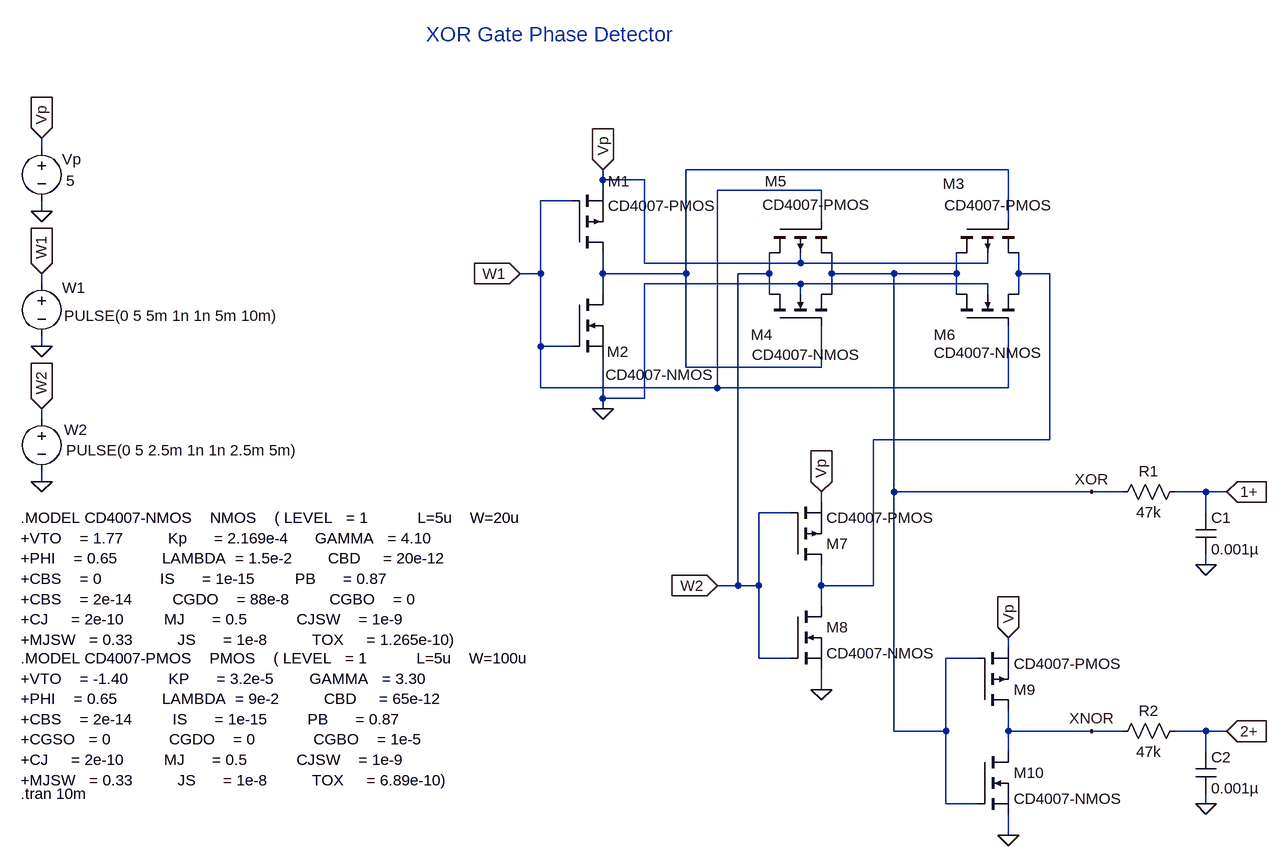
[diagram p0: schematic xor_gate_phase_detector.asc]
xor_gate_phase_detector.asc, the LTspice schematic file:
Version 4
SHEET 1 1500 1752
WIRE -1104 112 -1104 96
WIRE 384 144 -112 144
WIRE -240 160 -240 144
WIRE -176 160 -240 160
WIRE -240 176 -240 160
WIRE 96 176 -64 176
WIRE -288 192 -336 192
WIRE -1104 208 -1104 192
WIRE 96 224 96 176
WIRE 384 224 384 144
WIRE -176 288 -176 160
WIRE 64 288 64 272
WIRE 64 288 -176 288
WIRE 352 288 352 272
WIRE 352 288 64 288
WIRE -336 304 -336 192
WIRE -336 304 -368 304
WIRE -240 304 -240 272
WIRE -112 304 -112 144
WIRE -112 304 -240 304
WIRE 16 304 16 272
WIRE 16 304 -32 304
WIRE 112 304 112 272
WIRE 208 304 112 304
WIRE 304 304 304 272
WIRE 304 304 208 304
WIRE 400 304 400 272
WIRE 448 304 400 304
WIRE -1104 320 -1104 304
WIRE 64 320 -176 320
WIRE 352 320 64 320
WIRE -240 336 -240 304
WIRE 16 336 16 304
WIRE 64 336 64 320
WIRE 112 336 112 304
WIRE 304 336 304 304
WIRE 352 336 352 320
WIRE 400 336 400 304
WIRE -1104 416 -1104 400
WIRE -336 416 -336 304
WIRE -288 416 -336 416
WIRE -112 448 -112 304
WIRE 96 448 96 384
WIRE 96 448 -112 448
WIRE -336 480 -336 416
WIRE -64 480 -64 176
WIRE -64 480 -336 480
WIRE 384 480 384 384
WIRE 384 480 -64 480
WIRE -240 496 -240 432
WIRE -176 496 -176 320
WIRE -176 496 -240 496
WIRE -240 512 -240 496
WIRE -1104 528 -1104 512
WIRE 448 560 448 304
WIRE 448 560 176 560
WIRE -1104 624 -1104 608
WIRE 208 640 208 304
WIRE 512 640 208 640
WIRE 560 640 512 640
WIRE 688 640 640 640
WIRE 720 640 688 640
WIRE 96 656 96 640
WIRE 48 672 0 672
WIRE 688 672 688 640
WIRE 688 752 688 736
WIRE -32 784 -32 304
WIRE -32 784 -64 784
WIRE 0 784 0 672
WIRE 0 784 -32 784
WIRE 96 784 96 752
WIRE 176 784 176 560
WIRE 176 784 96 784
WIRE 96 816 96 784
WIRE 384 880 384 864
WIRE 0 896 0 784
WIRE 48 896 0 896
WIRE 336 896 288 896
WIRE 96 944 96 912
WIRE 208 1008 208 640
WIRE 288 1008 288 896
WIRE 288 1008 208 1008
WIRE 384 1008 384 976
WIRE 512 1008 384 1008
WIRE 560 1008 512 1008
WIRE 688 1008 640 1008
WIRE 720 1008 688 1008
WIRE 384 1040 384 1008
WIRE 688 1040 688 1008
WIRE 288 1120 288 1008
WIRE 336 1120 288 1120
WIRE 688 1120 688 1104
WIRE 384 1168 384 1136
FLAG -240 512 0
FLAG -240 144 Vp
IOPIN -240 144 In
FLAG -368 304 W1
IOPIN -368 304 In
FLAG -64 784 W2
IOPIN -64 784 In
FLAG 96 944 0
FLAG -1104 416 0
FLAG -1104 208 0
FLAG -1104 96 Vp
IOPIN -1104 96 In
FLAG -1104 304 W1
IOPIN -1104 304 In
FLAG -1104 624 0
FLAG -1104 512 W2
IOPIN -1104 512 In
FLAG 96 640 Vp
IOPIN 96 640 In
FLAG 720 640 1+
IOPIN 720 640 In
FLAG 688 752 0
FLAG 384 1168 0
FLAG 384 864 Vp
IOPIN 384 864 In
FLAG 720 1008 2+
IOPIN 720 1008 In
FLAG 688 1120 0
FLAG 512 1008 XNOR
FLAG 512 640 XOR
SYMBOL pmos -288 272 M180
WINDOW 0 56 110 Left 2
SYMATTR InstName M1
SYMATTR Value CD4007-PMOS
SYMBOL pmos 48 752 M180
SYMATTR InstName M7
SYMATTR Value CD4007-PMOS
SYMBOL nmos -288 336 R0
WINDOW 0 54 88 Left 2
WINDOW 3 52 124 Left 2
SYMATTR InstName M2
SYMATTR Value CD4007-NMOS
SYMBOL nmos 48 816 R0
SYMATTR InstName M8
SYMATTR Value CD4007-NMOS
SYMBOL voltage -1104 304 R0
WINDOW 3 35 65 Left 2
WINDOW 123 0 0 Left 0
WINDOW 39 0 0 Left 0
WINDOW 0 32 22 Left 2
SYMATTR Value PULSE(0 5 5m 1n 1n 5m 10m)
SYMATTR InstName W1
SYMBOL voltage -1104 96 R0
WINDOW 123 0 0 Left 0
WINDOW 39 0 0 Left 0
WINDOW 0 32 32 Left 2
WINDOW 3 38 65 Left 2
SYMATTR InstName Vp
SYMATTR Value 5
SYMBOL voltage -1104 512 R0
WINDOW 3 38 64 Left 2
WINDOW 123 0 0 Left 0
WINDOW 39 0 0 Left 0
WINDOW 0 35 32 Left 2
SYMATTR Value PULSE(0 5 2.5m 1n 1n 2.5m 5m)
SYMATTR InstName W2
SYMBOL pmos4 16 224 M90
WINDOW 0 -62 27 VLeft 2
WINDOW 3 -26 157 VLeft 2
SYMATTR InstName M5
SYMATTR Value CD4007-PMOS
SYMBOL pmos4 304 224 M90
WINDOW 0 -58 13 VLeft 2
WINDOW 3 -25 149 VLeft 2
SYMATTR InstName M3
SYMATTR Value CD4007-PMOS
SYMBOL nmos4 16 384 R270
WINDOW 0 -14 -28 VRight 2
WINDOW 3 -45 -27 VRight 2
SYMATTR InstName M4
SYMATTR Value CD4007-NMOS
SYMBOL nmos4 304 384 R270
WINDOW 0 -14 -35 VRight 2
WINDOW 3 -42 -35 VRight 2
SYMATTR InstName M6
SYMATTR Value CD4007-NMOS
SYMBOL res 656 624 R90
WINDOW 0 0 56 VBottom 2
WINDOW 3 32 56 VTop 2
SYMATTR InstName R1
SYMATTR Value 47k
SYMBOL cap 672 672 R0
SYMATTR InstName C1
SYMATTR Value 0.001µ
SYMBOL pmos 336 976 M180
SYMATTR InstName M9
SYMATTR Value CD4007-PMOS
SYMBOL nmos 336 1040 R0
SYMATTR InstName M10
SYMATTR Value CD4007-NMOS
SYMBOL res 656 992 R90
WINDOW 0 0 56 VBottom 2
WINDOW 3 32 56 VTop 2
SYMATTR InstName R2
SYMATTR Value 47k
SYMBOL cap 672 1040 R0
SYMATTR InstName C2
SYMATTR Value 0.001µ
TEXT -512 -64 Left 3 ;XOR Gate Phase Detector
TEXT -1136 680 Left 2 !.MODEL CD4007-NMOS    NMOS    ( LEVEL   = 1           L=5u    W=20u             \n+VTO    = 1.77          Kp      = 2.169e-4      GAMMA   = 4.10  \n+PHI    = 0.65          LAMBDA  = 1.5e-2        CBD     = 20e-12\n+CBS    = 0             IS      = 1e-15         PB      = 0.87\n+CBS    = 2e-14         CGDO    = 88e-8         CGBO    = 0\n+CJ     = 2e-10         MJ      = 0.5           CJSW    = 1e-9\n+MJSW   = 0.33          JS      = 1e-8          TOX     = 1.265e-10)
TEXT -1136 896 Left 2 !.MODEL CD4007-PMOS    PMOS    ( LEVEL   = 1           L=5u    W=100u                \n+VTO    = -1.40         KP      = 3.2e-5        GAMMA   = 3.30  \n+PHI    = 0.65          LAMBDA  = 9e-2          CBD     = 65e-12\n+CBS    = 2e-14         IS      = 1e-15         PB      = 0.87\n+CGSO   = 0             CGDO    = 0             CGBO    = 1e-5\n+CJ     = 2e-10         MJ      = 0.5           CJSW    = 1e-9\n+MJSW   = 0.33          JS      = 1e-8          TOX     = 6.89e-10)
TEXT -1136 1104 Left 2 !.tran 10m

The netlist it stands for:
* xor_gate_phase_detector.asc
M1 N001 W1 Vp Vp CD4007-PMOS
M7 N002 W2 Vp Vp CD4007-PMOS
M2 N001 W1 0 0 CD4007-NMOS
M8 N002 W2 0 0 CD4007-NMOS
V§W1 W1 0 PULSE(0 5 5m 1n 1n 5m 10m)
Vp Vp 0 5
V§W2 W2 0 PULSE(0 5 2.5m 1n 1n 2.5m 5m)
M5 W2 W1 XOR Vp CD4007-PMOS
M3 XOR N001 N002 Vp CD4007-PMOS
M4 W2 N001 XOR 0 CD4007-NMOS
M6 XOR W1 N002 0 CD4007-NMOS
R1 1+ XOR 47k
C1 1+ 0 0.001µ
M9 XNOR XOR Vp Vp CD4007-PMOS
M10 XNOR XOR 0 0 CD4007-NMOS
R2 2+ XNOR 47k
C2 2+ 0 0.001µ
.model NMOS NMOS
.model PMOS PMOS
.lib standard.mos
* XOR Gate Phase Detector
.MODEL CD4007-NMOS    NMOS    ( LEVEL   = 1           L=5u    W=20u
+VTO    = 1.77          Kp      = 2.169e-4      GAMMA   = 4.10
+PHI    = 0.65          LAMBDA  = 1.5e-2        CBD     = 20e-12
+CBS    = 0             IS      = 1e-15         PB      = 0.87
+CBS    = 2e-14         CGDO    = 88e-8         CGBO    = 0
+CJ     = 2e-10         MJ      = 0.5           CJSW    = 1e-9
+MJSW   = 0.33          JS      = 1e-8          TOX     = 1.265e-10)
.MODEL CD4007-PMOS    PMOS    ( LEVEL   = 1           L=5u    W=100u
+VTO    = -1.40         KP      = 3.2e-5        GAMMA   = 3.30
+PHI    = 0.65          LAMBDA  = 9e-2          CBD     = 65e-12
+CBS    = 2e-14         IS      = 1e-15         PB      = 0.87
+CGSO   = 0             CGDO    = 0             CGBO    = 1e-5
+CJ     = 2e-10         MJ      = 0.5           CJSW    = 1e-9
+MJSW   = 0.33          JS      = 1e-8          TOX     = 6.89e-10)
.tran 10m
.backanno
.end